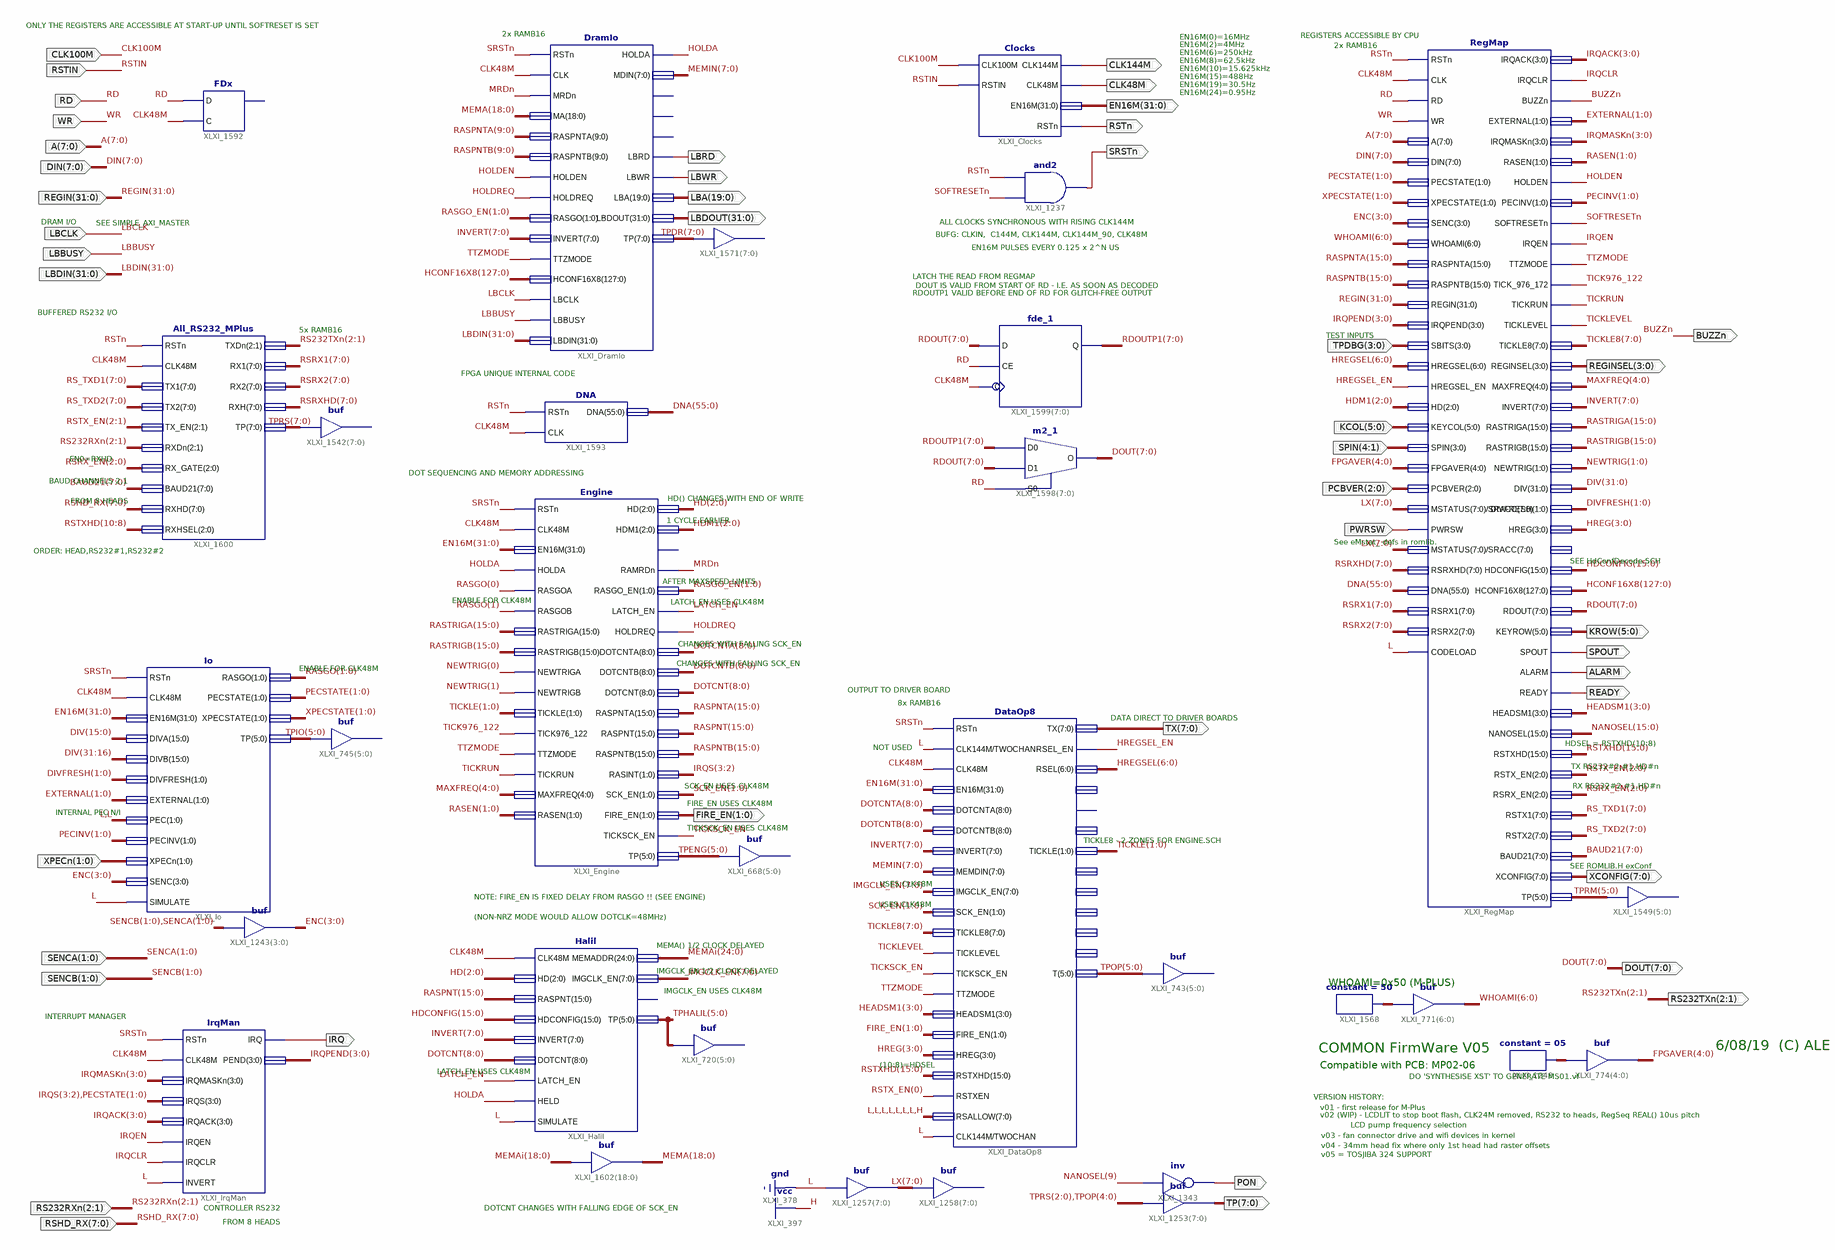
[diagram p0: schematic sheet 1]
// Xilinx ISE schematic Common.sch (spartan3e) as structural Verilog: 31 symbols, 43 ports
module Common (
  input  [31:0] REGIN,
  input  CLK100M,
  input  [7:0] A,
  input  RD,
  input  WR,
  input  [1:0] XPECn,
  input  [1:0] SENCB,
  input  [1:0] SENCA,
  input  [7:0] DIN,
  input  LBCLK,
  input  LBBUSY,
  input  [31:0] LBDIN,
  input  [3:0] TPDBG,
  input  [2:0] PCBVER,
  input  [5:0] KCOL,
  input  PWRSW,
  input  [4:1] SPIN,
  input  RSTIN,
  input  [2:1] RS232RXn,
  input  [7:0] RSHD_RX,
  output CLK48M,
  output RSTn,
  output CLK144M,
  output SRSTn,
  output [31:0] EN16M,
  output [1:0] FIRE_EN,
  output IRQ,
  output [7:0] TP,
  output [3:0] REGINSEL,
  output BUZZn,
  output [7:0] DOUT,
  output PON,
  output [2:1] RS232TXn,
  output [7:0] TX,
  output [5:0] KROW,
  output ALARM,
  output READY,
  output SPOUT,
  output [7:0] XCONFIG,
  output LBRD,
  output LBWR,
  output [19:0] LBA,
  output [31:0] LBDOUT
);

  wire HOLDA, HOLDEN, HOLDREQ, HREGSEL_EN, IRQCLR, IRQEN, LATCH_EN, MRDn, SOFTRESETn, TICK976_122, TICKLEVEL,
       TICKRUN, TICKSCK_EN, TTZMODE;
  wire [1:0] DIVFRESH, EXTERNAL, NEWTRIG, PECINV, PECSTATE, RASEN, RASGO, RASGO_EN, SCK_EN, TICKLE, XPECSTATE;
  wire [2:0] HD, HDM1, RSRX_EN, RSTX_EN;
  wire [3:0] ENC, HEADSM1, HREG, IRQACK, IRQMASKn, IRQPEND;
  wire [3:2] IRQS;
  wire [4:0] FPGAVER, MAXFREQ, XLXN_1745;
  wire [5:0] TPENG, TPHALIL, TPIO, TPOP, TPRM;
  wire [6:0] HREGSEL, WHOAMI, XLXN_1762;
  wire [7:0] BAUD21, IMGCLK_EN, INVERT, LX, MEMIN, RDOUT, RDOUTP1, RS_TXD1, RS_TXD2, RSRX1, RSRX2, RSRXHD,
       TICKLE8, TPDR, TPRS;
  wire [8:0] DOTCNT, DOTCNTA, DOTCNTB;
  wire [15:0] HDCONFIG, NANOSEL, RASPNT, RASPNTA, RASPNTB, RASTRIGA, RASTRIGB, RSTXHD;
  wire [18:0] MEMA;
  wire [24:0] MEMAi;
  wire [31:0] DIV;
  wire [55:0] DNA;
  wire [127:0] HCONF16X8;

  // buf XLXI_720[5..0] has open pins: I=TPHALIL, O=open
  // buf XLXI_668[5..0] has open pins: I=TPENG, O=open
  Engine XLXI_Engine (
    .CLK48M(CLK48M), .DOTCNT(DOTCNT), .DOTCNTA(DOTCNTA), .DOTCNTB(DOTCNTB), .EN16M(EN16M), .FIRE_EN(FIRE_EN),
    .HD(HD), .HDM1(HDM1), .HOLDA(HOLDA), .HOLDREQ(HOLDREQ), .LATCH_EN(LATCH_EN), .MAXFREQ(MAXFREQ),
    .NEWTRIGA(NEWTRIG[0]), .NEWTRIGB(NEWTRIG[1]), .RAMRDn(MRDn), .RASEN(RASEN), .RASGOA(RASGO[0]),
    .RASGOB(RASGO[1]), .RASGO_EN(RASGO_EN), .RASINT(IRQS), .RASPNT(RASPNT), .RASPNTA(RASPNTA),
    .RASPNTB(RASPNTB), .RASTRIGA(RASTRIGA), .RASTRIGB(RASTRIGB), .RSTn(SRSTn), .SCK_EN(SCK_EN),
    .TICK976_122(TICK976_122), .TICKLE(TICKLE), .TICKRUN(TICKRUN), .TICKSCK_EN(TICKSCK_EN), .TP(TPENG),
    .TTZMODE(TTZMODE));  // open: RAMWRn
  assign WHOAMI = XLXN_1762;  // buf XLXI_771[6..0], 7 bits wide
  constant #(.CValue("05")) XLXI_1248 (.O(XLXN_1745));
  assign FPGAVER = XLXN_1745;  // buf XLXI_774[4..0], 5 bits wide
  // buf XLXI_745[5..0] has open pins: I=TPIO, O=open
  Io XLXI_Io (
    .CLK48M(CLK48M), .EN16M(EN16M), .DIVA(DIV[15:0]), .DIVB(DIV[31:16]), .DIVFRESH(DIVFRESH),
    .EXTERNAL(EXTERNAL), .PEC(2'b00), .PECINV(PECINV), .PECSTATE(PECSTATE), .RASGO(RASGO), .RSTn(SRSTn),
    .SENC(ENC), .SIMULATE(1'b0), .TP(TPIO), .XPECn(XPECn), .XPECSTATE(XPECSTATE));
  assign ENC = {SENCB, SENCA};  // buf XLXI_1243[3..0], 4 bits wide
  IrqMan XLXI_IrqMan (
    .CLK48M(CLK48M), .IRQ(IRQ), .IRQACK(IRQACK), .IRQCLR(IRQCLR), .IRQEN(IRQEN), .IRQMASKn(IRQMASKn),
    .IRQS({IRQS, PECSTATE}), .PEND(IRQPEND), .RSTn(SRSTn), .INVERT(1'b0));
  assign TP = {TPRS[2:0], TPOP[4:0]};  // buf XLXI_1253[7..0], 8 bits wide
  constant #(.CValue("50")) XLXI_1568 (.O(XLXN_1762));
  and XLXI_1237 (SRSTn, SOFTRESETn, RSTn);
  Clocks XLXI_Clocks (.CLK100M(CLK100M), .CLK144M(CLK144M), .CLK48M(CLK48M), .EN16M(EN16M), .RSTIN(RSTIN), .RSTn(RSTn));
  not XLXI_1343 (PON, NANOSEL[9]);
  assign LX = {8{1'b0}};  // buf XLXI_1257[7..0], 8 bits wide
  // buf XLXI_1258[7..0] has open pins: I=LX, O=open
  FDx XLXI_1592 (.C(CLK48M), .D(RD));  // open: Q
  // buf XLXI_1542[7..0] has open pins: I=TPRS, O=open
  RegMap XLXI_RegMap (
    .A(A), .ALARM(ALARM), .BAUD21(BAUD21), .BUZZn(BUZZn), .CLK(CLK48M), .CODELOAD(1'b0), .DIN(DIN),
    .DIV(DIV), .DIVFRESH(DIVFRESH), .DNA(DNA), .EXTERNAL(EXTERNAL), .FPGAVER(FPGAVER), .HCONF16X8(HCONF16X8),
    .HD(HDM1), .HDCONFIG(HDCONFIG), .HEADSM1(HEADSM1), .HOLDEN(HOLDEN), .HREG(HREG), .HREGSEL(HREGSEL),
    .HREGSEL_EN(HREGSEL_EN), .INVERT(INVERT), .IRQACK(IRQACK), .IRQCLR(IRQCLR), .IRQEN(IRQEN),
    .IRQMASKn(IRQMASKn), .IRQPEND(IRQPEND), .KEYCOL(KCOL), .KEYROW(KROW), .MAXFREQ(MAXFREQ), .MSTATUS(LX),
    .NANOSEL(NANOSEL), .NEWTRIG(NEWTRIG), .PCBVER(PCBVER), .PECINV(PECINV), .PECSTATE(PECSTATE),
    .PWRSW(PWRSW), .RASEN(RASEN), .RASPNTA(RASPNTA), .RASPNTB(RASPNTB), .RASTRIGA(RASTRIGA),
    .RASTRIGB(RASTRIGB), .RD(RD), .RDOUT(RDOUT), .READY(READY), .REGIN(REGIN), .REGINSEL(REGINSEL),
    .RSRX1(RSRX1), .RSRX2(RSRX2), .RSRXHD(RSRXHD), .RSRX_EN(RSRX_EN), .RSTn(RSTn), .RSTX1(RS_TXD1),
    .RSTX2(RS_TXD2), .RSTXHD(RSTXHD), .RSTX_EN(RSTX_EN), .SBITS(TPDBG), .SENC(ENC), .SOFTRESETn(SOFTRESETn),
    .SPIN(SPIN), .SPOUT(SPOUT), .SRACC(LX), .TICKLE8(TICKLE8), .TICKLEVEL(TICKLEVEL), .TICKRUN(TICKRUN),
    .TICK_976_172(TICK976_122), .TP(TPRM), .TTZMODE(TTZMODE), .WHOAMI(WHOAMI), .WR(WR), .XCONFIG(XCONFIG),
    .XPECSTATE(XPECSTATE));  // open: HREG0
  // buf XLXI_1549[5..0] has open pins: I=TPRM, O=open
  // buf XLXI_1571[7..0] has open pins: I=TPDR, O=open
  DramIo XLXI_DramIo (
    .CLK(CLK48M), .HCONF16X8(HCONF16X8), .INVERT(INVERT), .HOLDA(HOLDA), .HOLDEN(HOLDEN), .HOLDREQ(HOLDREQ),
    .LBA(LBA), .LBBUSY(LBBUSY), .LBCLK(LBCLK), .LBDIN(LBDIN), .LBDOUT(LBDOUT), .LBRD(LBRD), .LBWR(LBWR),
    .MA(MEMA), .MDIN(MEMIN), .MRDn(MRDn), .RASGO(RASGO_EN), .RASPNTA(RASPNTA[9:0]), .RASPNTB(RASPNTB[9:0]),
    .RSTn(SRSTn), .TP(TPDR), .TTZMODE(TTZMODE));  // open: DRACT, DRDONE, DRRDY
  DNA XLXI_1593 (.CLK(CLK48M), .DNA(DNA), .RSTn(RSTn));
  m2_1 XLXI_1598[7:0] (.D0(RDOUTP1), .D1(RDOUT), .S0(RD), .O(DOUT));
  fde_1 XLXI_1599[7:0] (.C(CLK48M), .CE(RD), .D(RDOUT), .Q(RDOUTP1));
  Halil XLXI_Halil (
    .CLK48M(CLK48M), .DOTCNT(DOTCNT), .HD(HD), .HDCONFIG(HDCONFIG), .HELD(HOLDA), .IMGCLK_EN(IMGCLK_EN),
    .INVERT(INVERT), .LATCH_EN(LATCH_EN), .MEMADDR(MEMAi), .RASPNT(RASPNT), .SIMULATE(1'b0), .TP(TPHALIL));  // open: IMGCLRn
  All_RS232_MPlus XLXI_1600 (
    .BAUD21(BAUD21), .CLK48M(CLK48M), .RSTn(RSTn), .RX1(RSRX1), .RX2(RSRX2), .RXDn(RS232RXn), .RXH(RSRXHD),
    .RXHD(RSHD_RX), .RXHSEL(RSTXHD[10:8]), .RX_GATE(RSRX_EN), .TP(TPRS), .TX1(RS_TXD1), .TX2(RS_TXD2),
    .TXDn(RS232TXn), .TX_EN(RSTX_EN[2:1]));
  assign MEMA = MEMAi[18:0];  // buf XLXI_1602[18..0], 19 bits wide
  DataOp8 XLXI_DataOp8 (
    .CLK144M(1'b0), .CLK48M(CLK48M), .DOTCNTA(DOTCNTA), .DOTCNTB(DOTCNTB), .EN16M(EN16M), .FIRE_EN(FIRE_EN),
    .HEADSM1(HEADSM1), .HREG(HREG), .IMGCLK_EN(IMGCLK_EN), .INVERT(INVERT), .MEMDIN(MEMIN),
    .RSALLOW(8'b00000001), .RSEL(HREGSEL), .RSEL_EN(HREGSEL_EN), .RSTn(SRSTn), .RSTXEN(RSTX_EN[0]),
    .RSTXHD(RSTXHD), .SCK_EN(SCK_EN), .T(TPOP), .TICKLE(TICKLE), .TICKLE8(TICKLE8), .TICKLEVEL(TICKLEVEL),
    .TICKSCK_EN(TICKSCK_EN), .TTZMODE(TTZMODE), .TWOCHAN(1'b0), .TX(TX));  // open: D0, D0_EN, FIRE, RSRXSTAT, SDAT0, SDAT1, SD_CLK, SFIRE
  // buf XLXI_743[5..0] has open pins: I=TPOP, O=open

  // Notes on the sheet:
  //   ONLY THE REGISTERS ARE ACCESSIBLE AT START-UP UNTIL SOFTRESET IS SET
  //   2x RAMB16
  //   REGISTERS ACCESSIBLE BY CPU
  //   EN16M(0)=16MHz
  //   EN16M(2)=4MHz
  //   2x RAMB16
  //   EN16M(6)=250kHz
  //   EN16M(8)=62.5kHz
  //   EN16M(10)=15.625kHz
  //   EN16M(15)=488Hz
  //   EN16M(19)=30.5Hz
  //   EN16M(24)=0.95Hz
  //   DRAM I/O
  //   ALL CLOCKS SYNCHRONOUS WITH RISING CLK144M
  //   SEE SIMPLE_AXI_MASTER
  //   BUFG: CLKIN,  C144M, CLK144M, CLK144M_90, CLK48M
  //   EN16M PULSES EVERY 0.125 x 2^N US
  //   LATCH THE READ FROM REGMAP
  //   DOUT IS VALID FROM START OF RD - I.E. AS SOON AS DECODED
  //   RDOUTP1 VALID BEFORE END OF RD FOR GLITCH-FREE OUTPUT
  //   BUFFERED RS232 I/O
  //   5x RAMB16
  //   TEST INPUTS
  //   FPGA UNIQUE INTERNAL CODE
  //   EN0=RXHD
  //   DOT SEQUENCING AND MEMORY ADDRESSING
  //   BAUD CHANNELS 2,1
  //   HD() CHANGES WITH END OF WRITE
  //   FROM 8 HEADS
  //   1 CYCLE EARLIER
  //   See eMstat_ defs in romlib.
  //   ORDER: HEAD,RS232#1,RS232#2
  //   SEE HdConfDecode.SCH
  //   AFTER MAXSPEED LIMITS
  //   ENABLE FOR CLK48M
  //   LATCH_EN USES CLK48M
  //   CHANGES WITH FALLING SCK_EN
  //   CHANGES WITH FALLING SCK_EN
  //   ENABLE FOR CLK48M
  //   OUTPUT TO DRIVER BOARD
  //   8x RAMB16
  //   DATA DIRECT TO DRIVER BOARDS
  //   HDSEL = RSTXHD(10:8)
  //   NOT USED
  //   TX RS232#2,#1,HD#n
  //   SCK_EN USES CLK48M
  //   RX RS232#2,#1,HD#n
  //   FIRE_EN USES CLK48M
  //   INTERNAL PEC N/I
  //   TICKSCK_EN USES CLK48M
  //   TICKLE8 - 2 ZONES FOR ENGINE.SCH
  //   SEE ROMLIB.H exConf
  //   USES CLK48M
  //   NOTE: FIRE_EN IS FIXED DELAY FROM RASGO !! (SEE ENGINE)
  //   USES CLK48M
  //   (NON-NRZ MODE WOULD ALLOW DOTCLK=48MHz)
  //   MEMA() 1/2 CLOCK DELAYED
  //   IMGCLK_EN 1/2 CLOCK DELAYED
  //   WHOAMI=0x50 (M-PLUS)
  //   IMGCLK_EN USES CLK48M
  //   INTERRUPT MANAGER
  //   6/08/19  (C) ALE
  //   COMMON FirmWare V05
  //   (10:8)=HDSEL
  //   Compatible with PCB: MP02-06
  //   LATCH_EN USES CLK48M
  //   DO 'SYNTHESISE XST' TO GENERATE MS01.vf
  //   VERSION HISTORY:
  //   v01 - first release for M-Plus
  //   v02 (WIP) - LCDLIT to stop boot flash, CLK24M removed, RS232 to heads, RegSeq REAL() 10us pitch
  //   LCD pump frequency selection
  //   v03 - fan connector drive and wifi devices in kernel
  //   v04 - 34mm head fix where only 1st head had raster offsets
  //   v05 = TOSJIBA 324 SUPPORT
  //   CONTROLLER RS232
  //   DOTCNT CHANGES WITH FALLING EDGE OF SCK_EN
  //   FROM 8 HEADS
endmodule
